# EAGLE design same51-dev (EAGLE 9.5.0)
COMPANY: -; CREVISION: 1.0; DESIGNER: Rafael Silva; LICENSE: Licensed under Creative Commons Attribution-ShareAlike 3.0 Unported; LINK: https://github.com/gimbas/labrob-same51-devboard
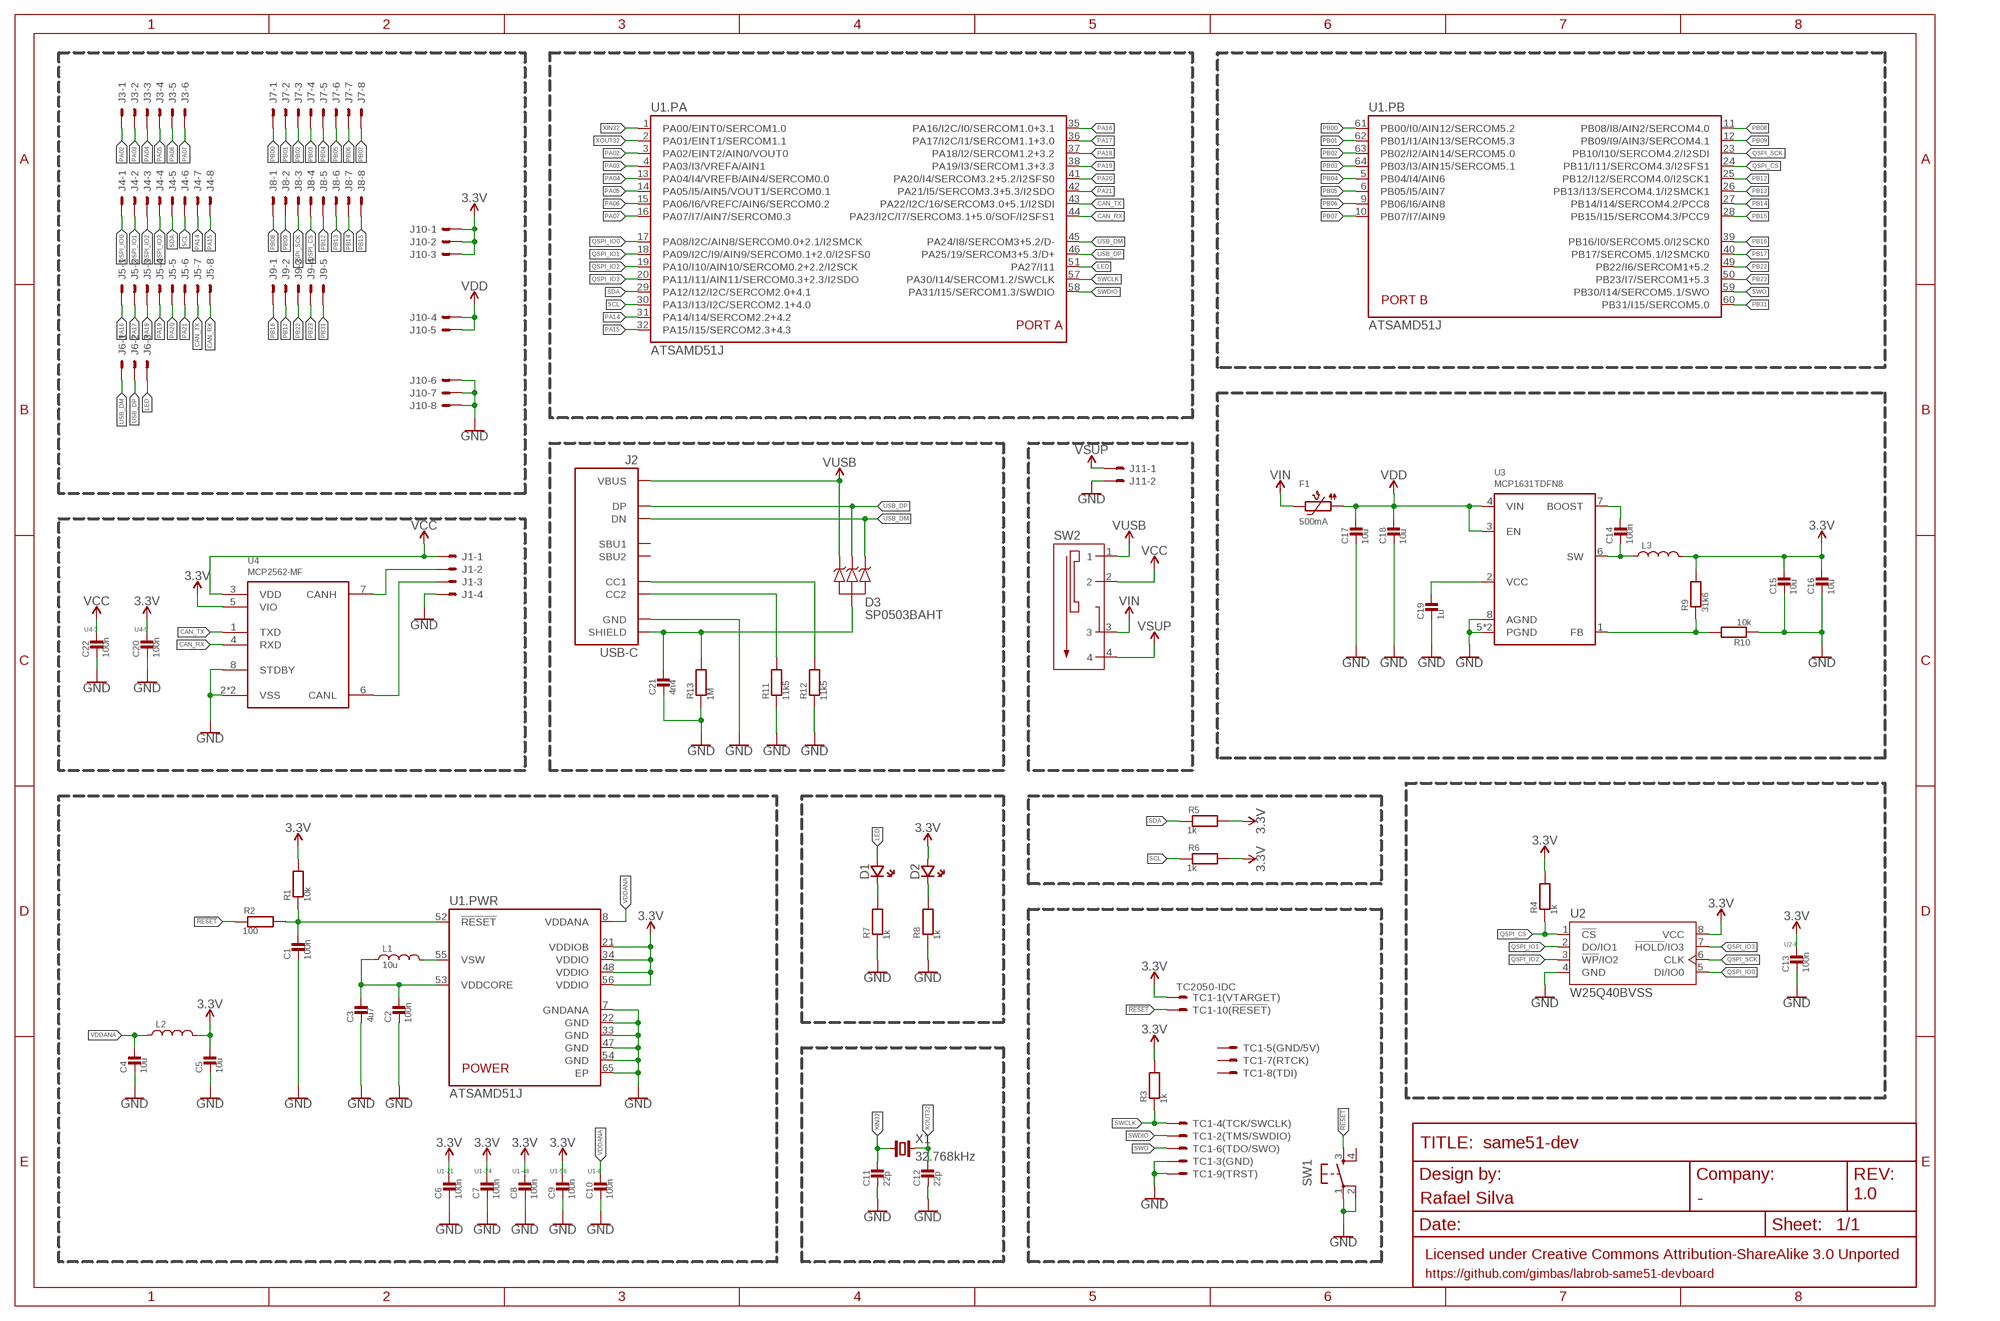
[diagram p0: schematic, sheet 1]

## Parts
C1  100n  MLCC0603  [0603_WAVE]
C2  100n  MLCC0603  [0603_WAVE]
C3  4u7  MLCC0603  [0603_WAVE]
C4  10u  MLCC0603  [0603_WAVE]
C5  10u  MLCC0603  [0603_WAVE]
C6  100n  MLCC0603  [0603_WAVE]
C7  100n  MLCC0603  [0603_WAVE]
C8  100n  MLCC0603  [0603_WAVE]
C9  100n  MLCC0603  [0603_WAVE]
C10  100n  MLCC0603  [0603_WAVE]
C11  22p  MLCC0603  [0603_WAVE]
C12  22p  MLCC0603  [0603_WAVE]
C13  100n  MLCC0603  [0603_WAVE]
C14  100n  MLCC0603  [0603_WAVE]
C15  10u  MLCC0603  [0603_WAVE]
C16  10u  MLCC0603  [0603_WAVE]
C17  10u  MLCC0603  [0603_WAVE]
C18  10u  MLCC0603  [0603_WAVE]
C19  1u  MLCC0603  [0603_WAVE]
C20  100n  MLCC0603  [0603_WAVE]
C21  4n4  MLCC0603  [0603_WAVE]
C22  100n  MLCC0603  [0603_WAVE]
D1  LED0603  [CHIPLED_0603]
D2  LED0603  [CHIPLED_0603]
D3  SP0503BAHT  [SOT143]
F1  500mA  PTC0805  [0805]
J1  4  [1X4_2.54]
J2  USB-C  [USB-C]
J3  6  [1X6_2.54]
J4  8  [1X8_2.54]
J5  8  [1X8_2.54]
J6  3  [1X3_2.54]
J7  8  [1X8_2.54]
J8  8  [1X8_2.54]
J9  5  [1X5_2.54]
J10  8  [1X8_2.54]
J11  2  [2X1_2.54]
L1  10u  INDUCTOR_NC_0806  [_0806]
L2  INDUCTOR_NC_0603  [_0603]
L3  INDUCTOR_NC_0806  [_0806]
R1  10k  RESISTOR0603  [0603_WAVE]
R2  100  RESISTOR0603  [0603_WAVE]
R3  1k  RESISTOR0603  [0603_WAVE]
R4  1k  RESISTOR0603  [0603_WAVE]
R5  1k  RESISTOR0603  [0603_WAVE]
R6  1k  RESISTOR0603  [0603_WAVE]
R7  1k  RESISTOR0603  [0603_WAVE]
R8  1k  RESISTOR0603  [0603_WAVE]
R9  31k6  RESISTOR0603  [0603_WAVE]
R10  10k  RESISTOR0603  [0603_WAVE]
R11  11k5  RESISTOR0603  [0603_WAVE]
R12  11k5  RESISTOR0603  [0603_WAVE]
R13  1M  RESISTOR0603  [0603_WAVE]
SW1  PUSH_BUTTON3X4X2  [3X4X2]
SW2  MSK-13C01  [MSK-13C01]
TC1  TC2050-IDC  [TC2050-IDC]
U1  ATSAMD51J  [VQFN64]
U2  W25Q40BVSS  [SO08-SS]
U3  MCP1631TDFN8  [TDFN8]
U4  MCP2562-MF  [DFN8]
X1  32.768kHz  CRYSTAL2-SMD-3215  [2-SMD-3215]

## Nets
3.3V: C5.P$1 C6.P$1 C7.P$1 C8.P$1 C9.P$1 C13.P$1 C15.P$1 C16.P$1 C20.P$1 D2.A(AN) J10.1 J10.2 J10.3 L2.2 L3.2 R1.P$2 R3.P$2 R4.P$2 R5.P$2 R6.P$2 R9.P$2 TC1.1 U1.21(.PWR:VDDIOB) U1.34(.PWR:VDDIO) U1.48(.PWR:VDDIO) U1.56(.PWR:VDDIO) U2.8(VCC) U4.5(VIO)
!RESET: R2.P$1 SW1.3 TC1.10
CAN_RX: J5.8 U1.44(.PA:PA23/I2C/I7/SERCOM3.1+5.0/SOF/I2SFS1) U4.4(RXD)
CAN_TX: J5.7 U1.43(.PA:PA22/I2C/16/SERCOM3.0+5.1/I2SDI) U4.1(TXD)
GND: C1.P$2 C2.P$2 C3.P$2 C4.P$2 C5.P$2 C6.P$2 C7.P$2 C8.P$2 C9.P$2 C10.P$2 C11.P$2 C12.P$2 C13.P$2 C15.P$2 C16.P$2 C17.P$2 C18.P$2 C19.P$2 C20.P$2 C21.P$2 C22.P$2 J1.4 J2.A1/B12(GND) J2.B1/A12(GND) J10.6 J10.7 J10.8 J11.2 R7.P$1 R8.P$1 R10.P$1 R11.P$1 R12.P$1 R13.P$1 SW1.1 SW1.2 TC1.3 TC1.9 U1.7(.PWR:GNDANA) U1.22(.PWR:GND) U1.33(.PWR:GND) U1.47(.PWR:GND) U1.54(.PWR:GND) U1.65(.PWR:EP) U2.4(GND) U3.5(PGND) U3.8(AGND) U3.9(PGND) U4.2(VSS) U4.8(STDBY) U4.9(VSS)
LED: D1.A(AN) J6.3 U1.51(.PA:PA27/I11)
N$1: C1.P$1 R1.P$1 R2.P$2 U1.52(.PWR:!RESET)
N$2: L1.2 U1.55(.PWR:VSW)
N$3: C2.P$1 C3.P$1 L1.1 U1.53(.PWR:VDDCORE)
N$4: C14.P$1 U3.7(BOOST)
N$5: C14.P$2 L3.1 U3.6(SW)
N$7: R9.P$1 R10.P$2 U3.1(FB)
N$8: C19.P$1 U3.2(VCC)
N$9: J1.3 U4.6(CANL)
N$11: J1.2 U4.7(CANH)
N$12: D1.C(CA) R7.P$2
N$13: C21.P$1 D3.1 J2.SHIELD0(SHIELD) J2.SHIELD1(SHIELD) J2.SHIELD2(SHIELD) J2.SHIELD3(SHIELD) R13.P$2
N$15: J2.B5(CC2) R11.P$2
N$16: J2.A5(CC1) R12.P$2
N$42: D2.C(CA) R8.P$2
PA02: J3.1 U1.3(.PA:PA02/EINT2/AIN0/VOUT0)
PA03: J3.2 U1.4(.PA:PA03/I3/VREFA/AIN1)
PA04: J3.3 U1.13(.PA:PA04/I4/VREFB/AIN4/SERCOM0.0)
PA05: J3.4 U1.14(.PA:PA05/I5/AIN5/VOUT1/SERCOM0.1)
PA06: J3.5 U1.15(.PA:PA06/I6/VREFC/AIN6/SERCOM0.2)
PA07: J3.6 U1.16(.PA:PA07/I7/AIN7/SERCOM0.3)
PA14: J4.7 U1.31(.PA:PA14/I14/SERCOM2.2+4.2)
PA15: J4.8 U1.32(.PA:PA15/I15/SERCOM2.3+4.3)
PA16: J5.1 U1.35(.PA:PA16/I2C/I0/SERCOM1.0+3.1)
PA17: J5.2 U1.36(.PA:PA17/I2C/I1/SERCOM1.1+3.0)
PA18: J5.3 U1.37(.PA:PA18/I2/SERCOM1.2+3.2)
PA19: J5.4 U1.38(.PA:PA19/I3/SERCOM1.3+3.3)
PA20: J5.5 U1.41(.PA:PA20/I4/SERCOM3.2+5.2/I2SFS0)
PA21: J5.6 U1.42(.PA:PA21/I5/SERCOM3.3+5.3/I2SDO)
PB00: J7.1 U1.61(.PB:PB00/I0/AIN12/SERCOM5.2)
PB01: J7.2 U1.62(.PB:PB01/I1/AIN13/SERCOM5.3)
PB02: J7.3 U1.63(.PB:PB02/I2/AIN14/SERCOM5.0)
PB03: J7.4 U1.64(.PB:PB03/I3/AIN15/SERCOM5.1)
PB04: J7.5 U1.5(.PB:PB04/I4/AIN6)
PB05: J7.6 U1.6(.PB:PB05/I5/AIN7)
PB06: J7.7 U1.9(.PB:PB06/I6/AIN8)
PB07: J7.8 U1.10(.PB:PB07/I7/AIN9)
PB08: J8.1 U1.11(.PB:PB08/I8/AIN2/SERCOM4.0)
PB09: J8.2 U1.12(.PB:PB09/I9/AIN3/SERCOM4.1)
PB12: J8.5 U1.25(.PB:PB12/I12/SERCOM4.0/I2SCK1)
PB13: J8.6 U1.26(.PB:PB13/I13/SERCOM4.1/I2SMCK1)
PB14: J8.7 U1.27(.PB:PB14/I14/SERCOM4.2/PCC8)
PB15: J8.8 U1.28(.PB:PB15/I15/SERCOM4.3/PCC9)
PB16: J9.1 U1.39(.PB:PB16/I0/SERCOM5.0/I2SCK0)
PB17: J9.2 U1.40(.PB:PB17/SERCOM5.1/I2SMCK0)
PB22: J9.3 U1.49(.PB:PB22/I6/SERCOM1+5.2)
PB23: J9.4 U1.50(.PB:PB23/I7/SERCOM1+5.3)
PB31: J9.5 U1.60(.PB:PB31/I15/SERCOM5.0)
QSPI_CS: J8.4 R4.P$1 U1.24(.PB:PB11/I11/SERCOM4.3/I2SFS1) U2.1(!CS!)
QSPI_IO0: J4.1 U1.17(.PA:PA08/I2C/AIN8/SERCOM0.0+2.1/I2SMCK) U2.5(DI/IO0)
QSPI_IO1: J4.2 U1.18(.PA:PA09/I2C/I9/AIN9/SERCOM0.1+2.0/I2SFS0) U2.2(DO/IO1)
QSPI_IO2: J4.3 U1.19(.PA:PA10/I10/AIN10/SERCOM0.2+2.2/I2SCK) U2.3(!WP!/IO2)
QSPI_IO3: J4.4 U1.20(.PA:PA11/I11/AIN11/SERCOM0.3+2.3/I2SDO) U2.7(!HOLD!/IO3)
QSPI_SCK: J8.3 U1.23(.PB:PB10/I10/SERCOM4.2/I2SDI) U2.6(CLK)
SCL: J4.6 R6.P$1 U1.30(.PA:PA13/I13/I2C/SERCOM2.1+4.0)
SDA: J4.5 R5.P$1 U1.29(.PA:PA12/I12/I2C/SERCOM2.0+4.1)
SWCLK: R3.P$1 TC1.4 U1.57(.PA:PA30/I14/SERCOM1.2/SWCLK)
SWDIO: TC1.2 U1.58(.PA:PA31/I15/SERCOM1.3/SWDIO)
SWO: TC1.6 U1.59(.PB:PB30/I14/SERCOM5.1/SWO)
USB_DM: D3.4 J2.A7(DN) J2.B7(DN) J6.1 U1.45(.PA:PA24/I8/SERCOM3+5.2/D-)
USB_DP: D3.3 J2.A6(DP) J2.B6(DP) J6.2 U1.46(.PA:PA25/19/SERCOM3+5.3/D+)
VCC: C22.P$1 J1.1 SW2.2 U4.3(VDD)
VDD: C17.P$1 C18.P$1 F1.1 J10.4 J10.5 U3.3(EN) U3.4(VIN)
VDDANA: C4.P$1 C10.P$1 L2.1 U1.8(.PWR:VDDANA)
VIN: F1.2 SW2.3
VSUP: J11.1 SW2.4
VUSB: D3.2 J2.A4/B9(VBUS) J2.B4/A9(VBUS) SW2.1
XIN32: C11.P$1 U1.1(.PA:PA00/EINT0/SERCOM1.0) X1.1
XOUT32: C12.P$1 U1.2(.PA:PA01/EINT1/SERCOM1.1) X1.2
Unconnected: J2.A8(SBU1) J2.B8(SBU2) SW1.4 TC1.5 TC1.7 TC1.8

## Notes on the sheet
- U4-3 | U4-5
- U2-8
- U1-21 | U1-34 | U1-48 | U1-56 | U1-8

## Library data of the parts
C1-C22 = Passive Components > Capacitors > Multilayer Ceramic Capacitors MLCC:MLCC: KEMET’s X7R dielectric features a 125°C maximum operating temperature and is considered temperature stable. The Electronics Components, Assemblies and Materials Association (EIA) characterizes X7R dielectric as a Class II material. Components of this classification are fixed, ceramic dielectric capacitors suited for bypass and decoupling applications or for frequency discriminating circuits where Q and stability of capacitance characteristics are not critical. X7R exhibits a predictable change in capacitance with respect to time and voltage, boasting a minimal change in capacitance with reference to ambient temperature. Capacitance change is limited to ±15% from −55°C to +125°C.
D1 D2 = Opto-electronics > LED Emitters:LED: LED 0603 - 0603 Surface Mount Package 2mA: Green LED - Low Power (3.9mcd, 2ma, 1.7Vf) - Digikey: 475-2709-2-ND Orange LED - Low Power (9.8mcd, 2ma, 1.8Vf) - Digikey: 475-1194-2-ND Red LED - Low Power (5mcd, 2ma, 1.8Vf) - Digikey: 475-1195-2-ND Yellow LED - Low Power (7mcd, 2ma, 1.8Vf) - Digikey: 475-1196-2-ND 5mA: Blue LED - Low Power (17mcd, 5ma, 2.9Vf) - Digikey: LNJ937W8CRACT-ND 0805 - 0805 Surface Mount Package 2mA: Red LED (8.8mcd, 2mA, 1.8Vf, Clear) - Low Power [Digikey: 475-2510-1-ND] Green LED (5mcd, 2mA, 1.8Vf, Clear) - Low Power [Digikey: 475-2730-1-ND] Yellow LED (11.3mcd, 2mA, 1.8Vf, Clear) - Low Power [Digikey: 475-2555-1-ND] 20mA: Red LED (104mcd, 20mA, Diffused) - LS R976 [Digikey: 475-1278-6-ND] Red LED (12mcd, 20mA, 2.0Vf, Clear) - APT2012EC [Digikey: 754-1128-1-ND] Green LED (15mcd, 20mA, 2.2Vf, Clear) - APT2012GC [Digikey: 754-1131-1-ND] Orange LED (160mcd, 20mA, 2.1Vf, Clear) - APT2012SECK [Digikey: 754-1130-1-ND] 1206 - 1206 Surface Mount Package Green LED (26mcd, 20mA, Diffused) - LG N971 [Digikey: 475-1407-6-ND] Red LED (15mcd, 20mA, Diffused) - LH N974 [Digikey: 475-1416-6-ND] Cree - Cree High-Power Surface Mount LEDs XPEBWT-L1-0000-00D50 - White 111lm 350mA 2.9Vf 6200K 110° XTEAWT-00-0000-00000LEE3 - White 114lm 350mA 2.85Vf 5000K 115° Everlight - Everlight 45-21 Series Surface Mount LEDs 45-21/QK2C-B2832AC2CB2/2T - Warm White 2000mcd 20mA 3.25Vf 3050K 120° 45-21/LK2C-B38452C4CB2/2T - Nuetral White 2000mcd 20mA 3.25Vf 4150K 120° 45-21/LK2C-B50634C6CB2/2T - Cold White 2200mcd 20mA 3.25Vf 5650K 120° PLCC2 Reverse Mount LS T77K-J1L2-1-0-2-R18-Z - Red 11.25mcd 2mA 1.8Vf 630nm 120° LO T77K-L1M2-24-Z - Orange 19.6mcd 2mA 1.8Vf 606nm 120° LY T77K-K2M1-26-Z - Yellow 15.7mcd 2mA 1.8Vf 587nm 120°
D3 = Circuit Protection > ESD Suppressors \ TVS Diodes:SP0503BAHT
F1 = Circuit Protection > Resettable Fuses - PPTC:PTC
J1 = Connectors > Header:4
J2 = Connectors > USB:USB-C
J3 = Connectors > Header:6
J4 J5 J7 J8 J10 = Connectors > Header:8
J6 = Connectors > Header:3
J9 = Connectors > Header:5
J11 = Connectors > Header:2
L1-L3 = Passive Components > Inductors, Chokes & Coils:INDUCTOR_NC
R1-R13 = Passive Components > Resistors > Chip Resistors:RESISTOR: Resistors For new designs, use the packages preceded by an '_' character since they are more reliable: The following footprints should be used on most boards: _0402 - Standard footprint for regular board layouts _0603 - Standard footprint for regular board layouts _0805 - Standard footprint for regular board layouts _1206 - Standard footprint for regular board layouts For extremely tight-pitch boards where space is at a premium, the following 'micro-pitch' footprints can be used (smaller pads, no silkscreen outline, etc.): _0402MP - Micro-pitch footprint for very dense/compact boards _0603MP - Micro-pitch footprint for very dense/compact boards _0805MP - Micro-pitch footprint for very dense/compact boards _1206MP - Micro-pitch footprint for very dense/compact boards
SW1 = Eletromechanical > Switches > Tactile Switches:PUSH_BUTTON
SW2 = Eletromechanical > Switches > Toggle Switches:MSK-13C01
TC1 = Connectors > Other:TC2050-IDC
U1 = Semiconductors > Embedded Processors & Controllers > Microcontrollers - MCU:ATSAMD51J: ATSAMD51J cortex m4 microcontroller
U2 = Semiconductors > Integrated Circuits - ICs > Memory ICs > Flash:W25Q40BV: EEPROM 4 Mbit SPI Serial Flash with Dual and Quad SPI
U3 = Power > Switching Controllers:MCP1631*
U4 = Semiconductors > Integrated Circuits - ICs > Interface ICs > CAN Interface IC:MCP2562
X1 = Passive Components > Frequency Control & Timing Devices > Crystals:CRYSTAL

## Board
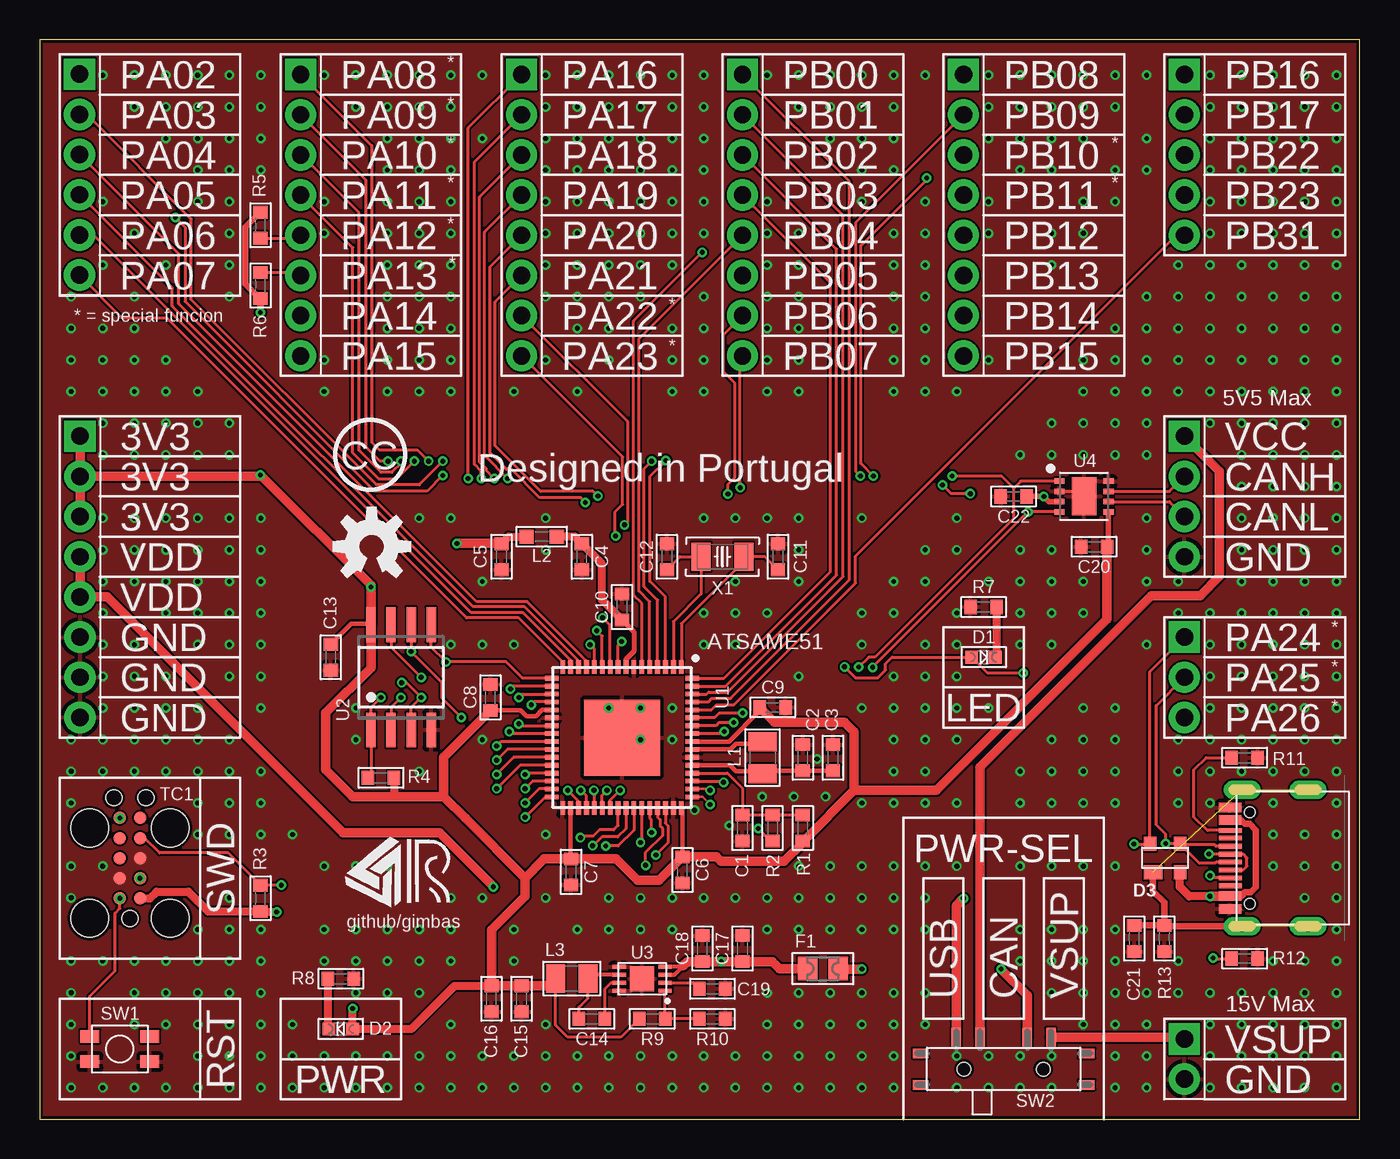
[diagram p1: board, top side]
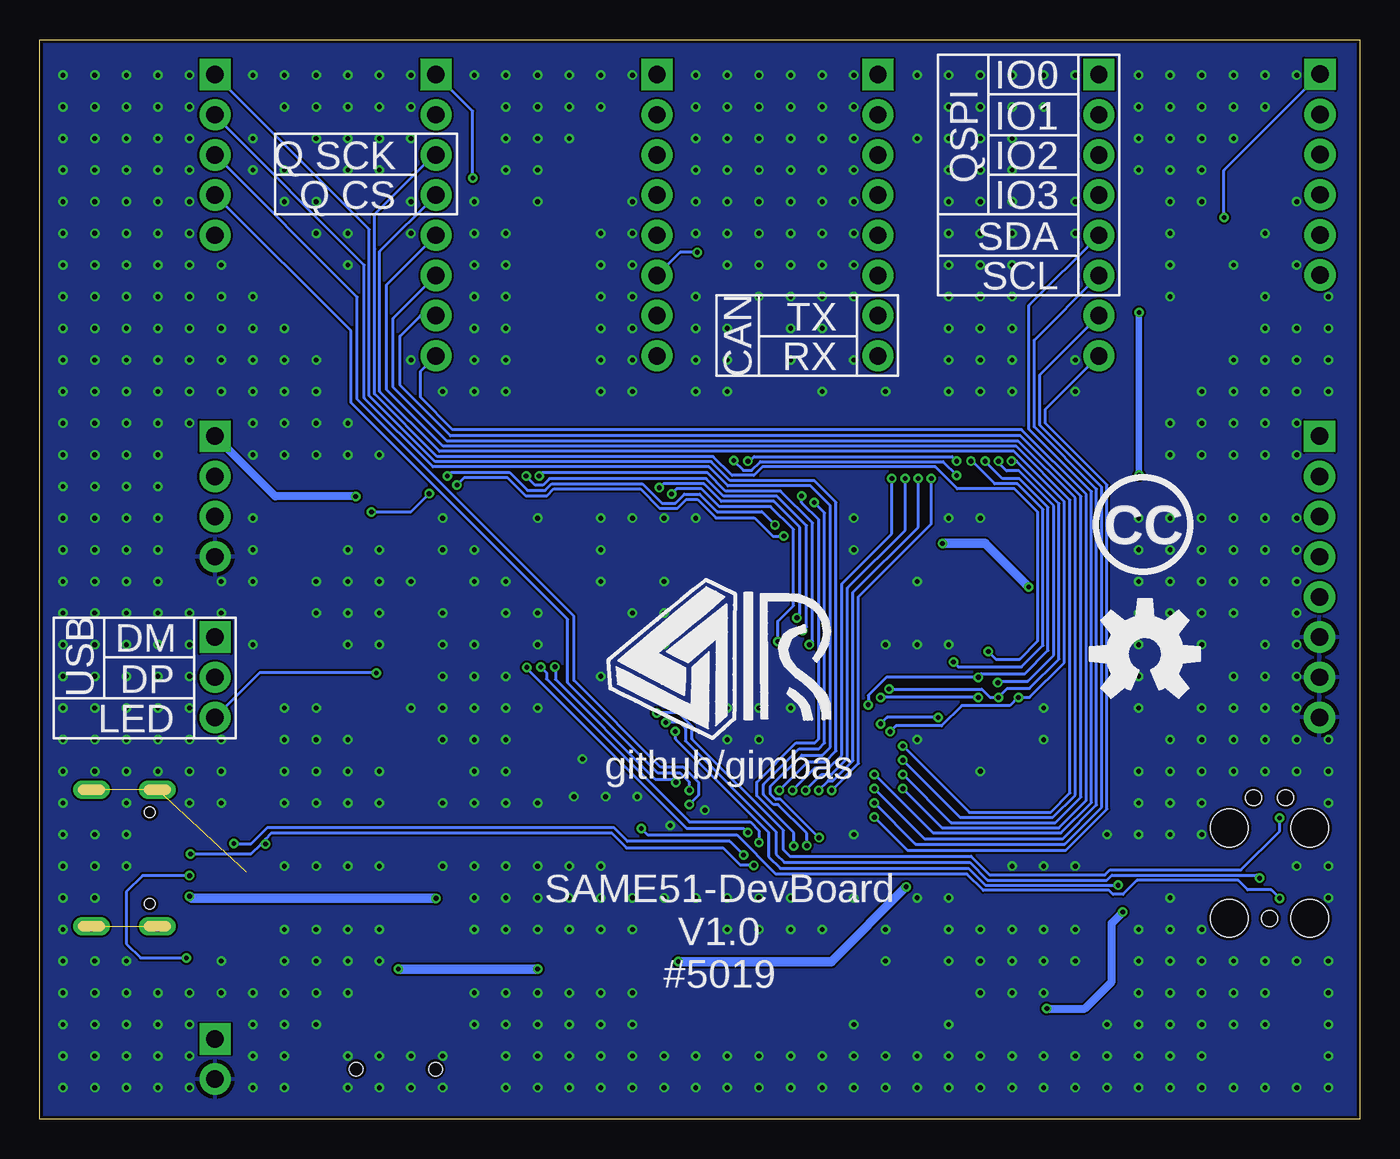
[diagram p2: board, bottom side, seen from below]

Size 83.49 x 68.25 mm. Coordinates in mm from the lower left corner, seen from the top.
Outline: 0,0 83.49,0 83.49,68.25 0,68.25 0,0
Copper layers (1*16): Top 0.035mm / dielectric 1.2mm / Bottom 0.035mm
Design rules "jlcpcb-2l-dr": minimum track width 5mil, minimum drill 0.3mm, track to track 5mil, track to pad 5mil, pad to pad 5mil, via to via 5mil, smd to smd 5mil, copper to edge 0.2mm, drill to drill 5mil, minimum pad ring 3mil, minimum via ring 3mil, stop-mask expansion 4mil, vias tented up to drill 0.5mm, thermal gap 10mil

### Footprints (pad centres in the part's own frame; a part is rotated, then mirrored left to right if it is on the bottom)
0603_WAVE = smd 0.8 x 0.9: P$1 -0.823,0; P$2 0.823,0
CHIPLED_0603 = smd 0.8 x 0.8: A 0,-0.75; C 0,0.75
SOT143 = smd 1.2 x 0.9: 1 -0.711,-0.889 | smd 0.8 x 0.9: 2 0.989,-0.889; 3 0.989,0.911; 4 -0.911,0.911
0805 = smd 1.245 x 1.473: 1 -0.965,0; 2 0.965,0
1X4_2.54 = drill 1.1 square: 1 -3.81,0 | drill 1.1: 2 -1.27,0; 3 1.27,0; 4 3.81,0
USB-C = smd 0.6 x 1.4: A1/B12 -3.2,7.276; A4/B9 -2.4,7.276; B1/A12 3.2,7.276; B4/A9 2.4,7.276 | smd 0.3 x 1.45: A5 -1.25,7.251; A6 -0.25,7.251; A7 0.25,7.251; A8 -1.75,7.251; B5 1.75,7.251; B6 0.75,7.251; B7 -0.75,7.251; B8 1.27,7.251 | drill 0.65 pad 1 long: SHIELD0 -4.32,6.526; SHIELD1 -4.32,2.346; SHIELD2 4.32,2.346; SHIELD3 4.32,6.526 | hole 0.65: -2.89,6.026; 2.89,6.026
1X6_2.54 = drill 1.1 square: 1 -2.54,0 | drill 1.1: 2 0,0; 3 2.54,0; 4 5.08,0; 5 7.62,0; 6 10.16,0
1X8_2.54 = drill 1.1 square: 1 -8.89,0 | drill 1.1: 2 -6.35,0; 3 -3.81,0; 4 -1.27,0; 5 1.27,0; 6 3.81,0; 7 6.35,0; 8 8.89,0
1X3_2.54 = drill 1.1 square: 1 -2.54,0 | drill 1.1: 2 0,0; 3 2.54,0
1X5_2.54 = drill 1.1 square: 1 -2.54,0 | drill 1.1: 2 0,0; 3 2.54,0; 4 5.08,0; 5 7.62,0
2X1_2.54 = drill 1.1 square: 1 -1.27,0 | drill 1.1: 2 1.27,0
_0806 = smd 1.2 x 1.8: 1 -1.016,0; 2 1.016,0
_0603 = smd 0.9 x 0.9: 1 -0.95,0; 2 0.95,0
3X4X2 = smd 1.2 x 0.8: 1 -1.9,0.8; 2 1.9,0.8; 3 1.9,-0.8; 4 -1.9,-0.8
MSK-13C01 = smd 0.6 x 1.2: 1 -3,2; 2 -1.5,2; 3 1.5,2; 4 3,2 | smd 1 x 0.6: S1 -5.25,1; S2 -5.25,-1; S3 5.25,1; S4 5.25,-1 | hole 0.85: -2.5,0; 2.5,0
TC2050-IDC = smd 0.787 x 0.787: 1 -2.54,-0.635; 2 -1.27,-0.635; 3 0,-0.635; 4 1.27,-0.635; 5 2.54,-0.635; 6 2.54,0.635; 7 1.27,0.635; 8 0,0.635; 9 -1.27,0.635; 10 -2.54,0.635 | hole 0.991: -3.81,0; 3.81,1.016; 3.81,-1.016 | hole 2.375: -3.81,2.54; -3.81,-2.54; 1.905,2.54; 1.905,-2.54
VQFN64 = smd 0.85 x 0.3: 1 -4.45,3.75; 2 -4.45,3.25; 3 -4.45,2.75; 4 -4.45,2.25; 5 -4.45,1.75; 6 -4.45,1.25; 7 -4.45,0.75; 8 -4.45,0.25; 9 -4.45,-0.25; 10 -4.45,-0.75; 11 -4.45,-1.25; 12 -4.45,-1.75; 13 -4.45,-2.25; 14 -4.45,-2.75; 15 -4.45,-3.25; 16 -4.45,-3.75; 33 4.45,-3.75; 34 4.45,-3.25; 35 4.45,-2.75; 36 4.45,-2.25; 37 4.45,-1.75; 38 4.45,-1.25; 39 4.45,-0.75; 40 4.45,-0.25; 41 4.45,0.25; 42 4.45,0.75; 43 4.45,1.25; 44 4.45,1.75; 45 4.45,2.25; 46 4.45,2.75; 47 4.45,3.25; 48 4.45,3.75 | smd 0.3 x 0.85: 17 -3.75,-4.45; 18 -3.25,-4.45; 19 -2.75,-4.45; 20 -2.25,-4.45; 21 -1.75,-4.45; 22 -1.25,-4.45; 23 -0.75,-4.45; 24 -0.25,-4.45; 25 0.25,-4.45; 26 0.75,-4.45; 27 1.25,-4.45; 28 1.75,-4.45; 29 2.25,-4.45; 30 2.75,-4.45; 31 3.25,-4.45; 32 3.75,-4.45; 49 3.75,4.45; 50 3.25,4.45; 51 2.75,4.45; 52 2.25,4.45; 53 1.75,4.45; 54 1.25,4.45; 55 0.75,4.45; 56 0.25,4.45; 57 -0.25,4.45; 58 -0.75,4.45; 59 -1.25,4.45; 60 -1.75,4.45; 61 -2.25,4.45; 62 -2.75,4.45; 63 -3.25,4.45; 64 -3.75,4.45 | smd 4.8 x 4.8: 65 0,0
SO08-SS = smd 0.6 x 2.2: 1 -1.905,-3.33; 2 -0.635,-3.33; 3 0.635,-3.33; 4 1.905,-3.33; 5 1.905,3.33; 6 0.635,3.33; 7 -0.635,3.33; 8 -1.905,3.33
TDFN8 = smd 0.85 x 0.25: 1 -1.45,0.75; 2 -1.45,0.25; 3 -1.45,-0.25; 4 -1.45,-0.75; 5 1.45,-0.75; 6 1.45,-0.25; 7 1.45,0.25; 8 1.45,0.75 | smd 1.5 x 1.6: 9 0,0
DFN8 = smd 0.65 x 0.35: 1 -1.55,0.975; 2 -1.55,0.325; 3 -1.55,-0.325; 4 -1.55,-0.975; 5 1.55,-0.975; 6 1.55,-0.325; 7 1.55,0.325; 8 1.55,0.975 | smd 1.55 x 2.4: 9 0,0
2-SMD-3215 = smd 1.2 x 1.8: 1 -1.35,0; 2 1.35,0

### Placement (x,y rotation side)
C1  44.45,18.41 270 top
C2  48.26,22.86 90 top
C3  50.16,22.86 90 top
C4  34.29,35.56 270 top
C5  29.21,35.56 270 top
C6  40.65,15.76 270 top
C7  33.61,15.64 270 top
C8  28.51,26.67 90 top
C9  46.35,26.04 0 top
C10  36.83,32.38 90 top
C11  46.69,35.56 90 top
C12  39.67,35.56 90 top
C13  18.41,29.21 270 top
C14  34.92,6.35 180 top
C15  30.48,7.62 270 top
C16  28.57,7.62 270 top
C17  44.45,10.79 90 top
C18  41.91,10.79 90 top
C19  42.55,8.26 0 top
C20  66.67,36.2 180 top
C21  69.22,11.43 270 top
C22  61.59,39.37 180 top
D1  59.69,29.21 270 top
D2  19.05,5.71 90 top
D3  71.12,16.51 0 top
F1  49.53,9.53 0 top
J1  72.39,39.37 270 top
J2  82.55,16.51 90 top
J3  2.53,63.52 270 top
J4  16.51,57.15 270 top
J5  30.48,57.15 270 top
J6  72.39,27.94 270 top
J7  44.45,57.15 270 top
J8  58.42,57.15 270 top
J9  72.39,63.5 270 top
J10  2.56,34.29 270 top
J11  72.39,3.81 270 top
L1  45.72,22.86 90 top
L2  31.75,36.83 180 top
L3  33.66,8.89 180 top
R1  48.26,18.41 270 top
R2  46.35,18.41 90 top
R3  13.97,13.97 270 top
R4  21.59,21.59 0 top
R5  13.97,56.52 90 top
R6  13.97,52.7 270 top
R7  59.69,32.38 0 top
R8  19.05,8.89 180 top
R9  38.73,6.35 180 top
R10  42.55,6.35 180 top
R11  76.2,22.86 180 top
R12  76.2,10.16 180 top
R13  71.12,11.43 90 top
SW1  5.08,4.45 180 top
SW2  60.96,3.17 0 top
TC1  5.71,16.51 90 top
U1  36.83,24.13 270 top
U2  22.86,27.94 0 top
U3  38.1,8.89 180 top
U4  66.04,39.37 0 top
U$1  [OSHW-LOGO-L]  13.6,29.4 0 bottom
U$2  [RAFAEL_SILVA_10MM_ALT]  47.5,24.1 0 bottom
U$3  [RAFAEL_SILVA_5MM_ALT_3]  20.1,15.4 0 top
U$4  [OSHW-LOGO-M]  21,36.2 0 top
X1  43.18,35.56 180 top

### Tracks (layer width: path | path; a pad name or v marks a point on that pad's centre or on a via)
3.3V  (via drill 0.3 pad 0.6)
  Top 0.2: 45.53,25.82 C9.P$1 | 67.59,36.29 C20.P$1 | R9.P$2 36.76,5.2 33.4,5.2 32.64,5.96 L3.2
  Top 0.3: C8.P$1 30.41,25.85 30.78,25.48 31.38,25.48 31.78,25.88 U1.21 | U1.56 43.03,23.88 43.04,23.87 43.57,23.87 43.58,23.88 43.59,23.88 45.53,25.82 | U1.34 33.58,16.67 C7.P$1 | C13.P$1 19.71,31.33 20.93,31.33 20.95,31.36 | 20.95,30.45 U2.8 | U1.48 40.65,19.61 C6.P$1
  Top 0.35: U4.5 67.59,36.29
  Top 0.4: 20.95,30.45 20.95,31.36
  Top 0.406: R5.P$2 13.94,57.34 13,56.4 13,52.8 13.92,51.88 R6.P$2 v13.97,51
  Top 0.5: C5.P$1 29.66,36.83 L2.2 | L3.2 32.19,8.44 | TC1.1 6.97,13.97 7.4,14.4 9.4,14.4 10.65,13.15 R3.P$2 14.02,13.1 v15,13.1 | C16.P$1 26.24,8.44 23.52,5.71 D2.A v19.8,7 | R4.P$2 22.41,20.41 22.4,20.4 | R1.P$2 48.29,17.59 | v20.95,33.66 20.95,33.74 | 14.06,40.64 v13.97,40.73 | 67.5,31.6 57.4,21.5
  Top 0.6: 47.07,16.3 48.26,17.49 | 48.29,17.59 51.5,20.8 56.7,20.8 67.5,31.6 C20.P$1 | 14.06,40.64 J10.2 | J10.2 J10.3 | J10.2 J10.1 | v26.4,36.4 29.19,36.4 C5.P$1 | 26.93,19.03 25.55,20.4 | 25.55,20.4 23.6,20.4 | 25.55,20.4 25.55,22.89 C8.P$1 | C7.P$1 31.91,16.46 30.7,15.25 30.7,14.1 28.57,11.97
  Top 0.61: 32.19,8.44 C15.P$1 C16.P$1 28.57,11.97 | 20.95,30.45 20.95,28.55 18.1,25.7 18.1,22.1 19.8,20.4 22.4,20.4 23.6,20.4 | 26.93,19.03 30.7,15.25 | C7.P$1 36.44,16.46 37.8,15.1 39.16,15.1 C6.P$1 42.81,16.59 43.1,16.3 47.07,16.3 | 48.26,17.49 R1.P$2 | C9.P$1 46.47,25.1 50.9,25.1 51.5,24.5 51.5,20.8 | U2.8 v20.95,33.66 | 20.95,33.74 14.06,40.64
  Bottom 0.406: v13.97,40.73 v13.97,51
  Bottom 0.5: v19.8,7 17.4,7 15.7,8.7 15.7,12.4 v15,13.1
  Bottom 0.6: 23.68,36.38 23.7,36.4 v26.4,36.4
  Bottom 0.61: v20.95,33.66 23.68,36.38
!RESET  (via drill 0.3 pad 0.6)
  Top 0.2: R2.P$1 46.23,17.59 v45.44,18.38 | SW1.3 3.18,7.78 4.78,9.38 4.78,13.03 5.08,13.33 TC1.10
  Bottom 0.2: TC1.10 5.61,14.5 7.1,14.5 7.7,15.1 14.1,15.1 14.98,14.22 15.62,14.22 15.87,14.47 23.82,14.47 24.85,15.5 36.92,15.5 39.4,17.98 45.04,17.98 v45.44,18.38
  other vias: 5.08,13.97
CAN_RX  (via drill 0.3 pad 0.6)
  Top 0.2: U1.44 38.58,19.04 38.68,18.94 38.68,18.15 v38.7,18.12 | v52.67,28.57 v62.5,38.4 U4.4 | v58.86,39.54 57.65,39.54 v57.1,40.1 | v36.43,36.87 36.36,36.93 36.36,38.36 36.87,38.87 36.87,41.87 J5.8
  Bottom 0.2: v38.7,18.12 38.95,18.37 42.55,18.37 52.67,28.49 v52.67,28.57 | v62.5,38.4 60.01,38.4 v58.86,39.54 | v57.1,40.1 56.62,40.57 53.92,40.57 52.77,39.43 51.39,39.43 50.97,39.85 45.5,39.85 44.28,38.62 43.15,38.62 42.58,39.19 41.89,39.19 40.72,38.02 38.29,38.02 37.13,36.87 v36.43,36.87
CAN_TX  (via drill 0.3 pad 0.6)
  Top 0.2: U4.1 62.05,40.34 61.6,39.9 | 61.6,39.9 61.6,38 52.82,29.22 52.43,29.22 v51.8,28.59 | v38,17.5 38.08,17.58 U1.43 | 61.6,39.9 60.84,40.66 v57.7,40.66 | v36.99,37.58 37.2,37.79 37.2,44.08 J5.7
  Bottom 0.2: v51.8,28.59 51.44,28.23 51.44,27.84 42.4,18.8 38.55,18.8 38,18.25 v38,17.5 | v57.7,40.66 57.46,40.9 53.78,40.9 52.64,39.76 51.53,39.76 51.11,40.17 45.37,40.17 44.14,38.95 43.29,38.95 42.72,39.52 41.76,39.52 40.64,38.41 37.81,38.41 v36.99,37.58
GND  (via drill 0.3)
  Top 0.2: U4.2 65.72,39.7 U4.9
  other vias: 2,2 4,2 6,2 8,2 10,2 12,2 14,2 16,2 18,2 20,2 22,2 24,2 26,2 28,2 30,2 32,2 34,2 36,2 38,2 40,2 42,2 44,2 46,2 48,2 50,2 52,2 54,2 58,2 60,2 62,2 64,2 68,2 70,2 74,2 76,2 78,2 80,2 82,2 2,4 10,4 12,4 14,4 16,4 18,4 20,4 22,4 24,4 26,4 28,4 30,4 32,4 34,4 36,4 38,4 40,4 42,4 44,4 46,4 48,4 50,4 52,4 54,4 58,4 60,4 62,4 64,4 68,4 70,4 74,4 76,4 78,4 80,4 82,4 2,6 6,6 8,6 10,6 12,6 14,6 16,6 26,6 32,6 46,6 48,6 50,6 52,6 54,6 56,6 66,6 68,6 70,6 74,6 76,6 78,6 80,6 82,6 2,8 6,8 8,8 10,8 12,8 14,8 20,8 22,8 24,8 46,8 48,8 50,8 52,8 54,8 56,8 64,8 66,8 68,8 70,8 72,8 74,8 76,8 78,8 80,8 82,8 2,10 4,10 6,10 8,10 10,10 12,10 14,10 18,10 20,10 22,10 24,10 26,10 30,10 62,10 64,10 66,10 68,10 72,10 78,10 80,10 82,10 10,12 12,12 14,12 18,12 20,12 22,12 24,12 26,12 30,12 34,12 36,12 38,12 40,12 46,12 48,12 50,12 52,12 54,12 56,12 62,12 64,12 66,12 68,12 82,12 2,14 12,14 26,14 28,14 32,14 36,14 38,14 40,14 42,14 44,14 46,14 48,14 50,14 52,14 54,14 56,14 80,14 82,14 2,16 4,16 18,16 20,16 22,16 48,16 50,16 52,16 54,16 56,16 58,16 62,16 64,16 66,16 68,16 78,16 80,16 82,16 10,18 12,18 14,18 16,18 32,18 78,18 80,18 82,18 2,20 10,20 12,20 14,20 45.7,20.4 47.7,20.4 49.7,20.4 52,20 54,20 56,20 58,20 62,20 64,20 66,20 68,20 72,20 74,20 78,20 82,20 2,22 4,22 6,22 8,22 10,22 12,22 14,22 24,22 54,22 56,22 62,22 64,22 66,22 68,22 72,22 74,22 76,22 78,22 80,22 82,22 2,24 4,24 6,24 8,24 10,24 12,24 20,24 28,24 38,24 40,24 54,24 56,24 58,24 64,24 66,24 68,24 72,24 74,24 76,24 78,24 80,24 82,24 4,26 6,26 8,26 10,26 14,26 20,26 36,26 38,26 40,26 52,26 54,26 56,26 58,26 60,26 66,26 68,26 74,26 76,26 78,26 80,26 82,26 4,28 6,28 8,28 12,28 14,28 48,28 54,28 56,28 58,28 74,28 76,28 78,28 80,28 82,28 4,30 6,30 10,30 12,30 14,30 26,30 28,30 30,30 42,30 44,30 52,30 56,30 58,30 62,30 64,30 70,30 74,30 76,30 78,30 80,30 82,30 4,32 8,32 10,32 12,32 14,32 42,32 44,32 46,32 52,32 54,32 58,32 62,32 64,32 66,32 72,32 74,32 76,32 78,32 80,32 82,32 4,34 6,34 8,34 10,34 12,34 14,34 28,34 44,34 48,34 54,34 56,34 60,34 62,34 64,34 66,34 70,34 72,34 76,34 78,34 80,34 82,34 4,36 6,36 8,36 10,36 12,36 14,36 32,36 48,36 56,36 58,36 62,36 64,36 70,36 76,36 78,36 80,36 82,36 4,38 6,38 8,38 10,38 12,38 14,38 24,38 26,38 32,38 42,38 44,38 46,38 48,38 52,38 58,38 70,38 76,38 78,38 80,38 82,38 76,40 78,40 80,40 82,40 4,42 6,42 8,42 10,42 12,42 62,42 64,42 66,42 68,42 70,42 76,42 78,42 80,42 82,42 4,44 6,44 8,44 10,44 12,44 64,44 66,44 68,44 70,44 74,44 76,44 78,44 80,44 82,44 2,46 4,46 6,46 8,46 10,46 18,46 22,46 24,46 26,46 30,46 34,46 40,46 42,46 46,46 48,46 54,46 56,46 58,46 66,46 68,46 70,46 72,46 74,46 76,46 78,46 80,46 82,46 2,48 4,48 6,48 8,48 18,48 22,48 24,48 26,48 32,48 36,48 40,48 42,48 46,48 48,48 54,48 56,48 60,48 66,48 68,48 70,48 72,48 74,48 76,48 78,48 80,48 82,48 2,50 4,50 6,50 22,50 24,50 26,50 34,50 36,50 40,50 42,50 46,50 48,50 54,50 56,50 68,50 70,50 72,50 74,50 76,50 78,50 80,50 82,50 2,52 6,52 12,52 22,52 24,52 26,52 32,52 34,52 36,52 38,52 42,52 46,52 48,52 54,52 56,52 70,52 72,52 74,52 76,52 78,52 80,52 82,52 4,54 8,54 12,54 22,54 24,54 26,54 32,54 34,54 36,54 38,54 40,54 46,54 48,54 54,54 56,54 64,54 72,54 74,54 76,54 78,54 80,54 82,54 6,56 12,56 18,56 22,56 24,56 26,56 32,56 34,56 36,56 38,56 40,56 42,56 46,56 48,56 54,56 56,56 60,56 64,56 66,56 74,56 76,56 78,56 80,56 82,56 4,58 10,58 12,58 18,58 22,58 24,58 26,58 32,58 34,58 36,58 38,58 40,58 42,58 46,58 52,58 56,58 60,58 66,58 68,58 74,58 76,58 78,58 80,58 82,58 10,60 12,60 14,60 22,60 24,60 26,60 32,60 34,60 36,60 38,60 40,60 42,60 52,60 54,60 62,60 64,60 68,60 70,60 74,60 76,60 78,60 80,60 82,60 8,62 10,62 12,62 14,62 22,62 24,62 26,62 28,62 32,62 34,62 36,62 38,62 40,62 42,62 50,62 52,62 54,62 60,62 62,62 64,62 66,62 70,62 74,62 76,62 78,62 80,62 82,62 6,64 8,64 10,64 12,64 14,64 20,64 22,64 24,64 26,64 32,64 34,64 36,64 38,64 40,64 42,64 48,64 50,64 52,64 54,64 60,64 62,64 64,64 66,64 68,64 74,64 76,64 78,64 80,64 82,64 4,66 6,66 8,66 10,66 12,66 14,66 18,66 20,66 22,66 24,66 26,66 28,66 32,66 34,66 36,66 38,66 40,66 42,66 46,66 48,66 50,66 52,66 54,66 56,66 60,66 62,66 64,66 66,66 68,66 70,66 74,66 76,66 78,66 80,66 82,66 49.16,22.77 41.41,19.54 43.62,18.57
  pour Bottom: -0.2,68.6 83.7,68.6 83.7,-0.2 -0.2,-0.2
  pour Top: -0.3,68.6 83.6,68.6 83.6,-0.2 -0.3,-0.2
LED  (via drill 0.3 pad 0.6)
  Top 0.2: U1.51 43.17,21.38 v43.25,21.3 | v50.9,28.6 51.6,27.9 53,27.9 53.5,28.4 53.5,28.8 53.91,29.21 D1.A 59.94,28.21 v62.19,28.21
  Bottom 0.2: J6.3 69.58,28.21 v62.19,28.21 | v43.25,21.3 43.45,21.5 44.56,21.5 50.88,27.82 50.88,28.58 v50.9,28.6
N$1
  Top 0.2: U1.52 43.49,21.88 44.45,20.92 C1.P$1 R2.P$2 R1.P$1
N$2
  Top 0.2: L1.2 45.57,23.73 45.4,23.73
  Top 0.3: U1.55 43.7,23.38 44.05,23.73 45.4,23.73
N$3
  Top 0.2: L1.1 45.57,21.99 45.3,21.99 | C2.P$1
  Top 0.3: U1.53 43.66,22.38 44.05,21.99 45.3,21.99 | L1.1 45.92,22.04 C2.P$1 | C2.P$1 C3.P$1
N$4
  Top 0.2: C14.P$1 35.75,8.25 36.14,8.64 U3.7
N$5
  Top 0.2: C14.P$2 34.1,7.09 34.67,7.66 L3.1 34.92,9.14
  Top 0.25: U3.6 34.92,9.14
N$7
  Top 0.2: U3.1 R9.P$1 R10.P$2
N$8
  Top 0.2: U3.2 41.34,8.64 C19.P$1
N$9
  Top 0.2: U4.6 71.44,39.05 J1.3
N$11
  Top 0.2: U4.7 71.44,39.7 J1.2
N$12
  Top 0.5: R7.P$2 60.51,29.28 D1.C
N$13  (3 unrouted)
  Top 0.2: 71.18,12.19 R13.P$2
  Top 0.4: J2.SHIELD0 71.18,12.19 | C21.P$1 R13.P$2 71.12,13.71 70.41,14.42 D3.1
N$15
  Top 0.2: J2.B5 73.84,18.26 73,19.1 73,22.1 73.76,22.86 R11.P$2
N$16  (via drill 0.3 pad 0.6)
  Top 0.2: J2.A5 74.14,15.26 v74,15.4 | v74.2,10.2 74.24,10.16 R12.P$2
  Bottom 0.2: v74,15.4 76.98,15.4 78,14.38 78,11.1 77.1,10.2 v74.2,10.2
N$42
  Top 0.5: R8.P$2 18.23,5.79 D2.C
PA02  (via drill 0.3 pad 0.6)
  Top 0.2: U1.3 39.58,33.02 38.6,34 38.6,40.64 v39.6,41.64 | v25.5,40.7 24.5,39.7 21.2,39.7 9.2,51.7 9.2,56.4 v8.6,57
  Bottom 0.2: v39.6,41.64 38.98,41.02 38.46,41.02 37.92,41.56 26.36,41.56 v25.5,40.7 | v8.6,57 8.6,59.98 J3.1
PA03  (via drill 0.3 pad 0.6)
  Top 0.2: U1.4 39.08,32.82 38.23,33.67 38.23,41.13 v38.7,41.6 | v25.5,41.6 24,40.1 21.3,40.1 9.6,51.8 9.6,56.9 3,63.5 J3.2
  Bottom 0.2: v38.7,41.6 38.6,41.6 38.31,41.89 25.79,41.89 v25.5,41.6
PA04
  Top 0.2: U1.13 34.56,28.6 34.56,29 30.83,32.73 27.64,32.73 8.8,51.56 8.8,54.7 J3.3
PA05
  Top 0.2: U1.14 34.08,28.98 30.66,32.4 27.4,32.4 8.4,51.4 8.4,52.56 J3.4
PA06
  Top 0.2: U1.15 33.58,29.02 30.57,32.03 27.27,32.03 3.42,55.88 J3.5
PA07
  Top 0.2: U1.16 33.08,28.92 30.3,31.7 27,31.7 8.06,50.64 5.24,50.64 J3.6
PA14  (via drill 0.3 pad 0.6)
  Top 0.2: U1.31 31.58,20.88 v30.7,20
  Bottom 0.2: v30.7,20 28.1,17.4 18.66,17.4 16.33,19.73 16.33,39.97 20.23,43.87 20.23,47.07 J4.7
PA15  (via drill 0.3 pad 0.6)
  Top 0.2: U1.32 31.98,20.38 v30.7,19.1
  Bottom 0.2: v30.7,19.1 28.6,17 18.6,17 16,19.6 16,40.1 19.9,44 19.9,44.87 J4.8
PA16  (via drill 0.3 pad 0.6)
  Top 0.2: U1.35 34.08,20.12 v33.4,20.8 | v27.1,40.5 27.1,62.66 J5.1
  Bottom 0.2: v33.4,20.8 31.7,22.5 31.7,33.05 27.1,37.65 v27.1,40.5
PA17  (via drill 0.3 pad 0.6)
  Top 0.2: U1.36 34.58,20.45 v34.23,20.8 | v27.93,40.5 27.93,40.97 27.5,41.4 27.5,60.52 J5.2
  Bottom 0.2: v34.23,20.8 33.62,21.41 33.31,21.41 32.05,22.67 32.05,33.32 27.93,37.44 v27.93,40.5
PA18  (via drill 0.3 pad 0.6)
  Top 0.2: U1.37 35.08,20.77 v35.05,20.8 | v28.75,40.5 28.25,41 28.25,41.11 27.83,41.53 27.83,58.31 J5.3
  Bottom 0.2: v35.05,20.8 34.05,21.81 33.41,21.81 32.4,22.82 32.4,33.6 28.75,37.24 v28.75,40.5
PA19  (via drill 0.3 pad 0.6)
  Top 0.2: U1.38 35.58,20.5 v35.88,20.8 | v29.6,40.5 28.2,41.9 28.15,41.9 28.15,56.09 J5.4
  Bottom 0.2: v35.88,20.8 34.46,22.22 33.57,22.22 32.77,23.02 32.77,33.85 29.6,37.02 v29.6,40.5
PA20  (via drill 0.3 pad 0.6)
  Top 0.2: U1.41 37.08,18.38 36.56,17.86 35.56,17.86 35,17.3 v34.97,17.3 | v34.51,38.99 34.21,39.29 31.62,39.29 29.84,41.08 29.52,41.08 28.48,42.12 28.48,53.88 J5.5
  Bottom 0.2: v34.97,17.3 34.97,18.07 36.8,19.9 37.08,19.9 37.71,20.53 37.71,21.17 35.47,23.41 34.22,23.41 33.85,23.79 33.85,38.33 v34.51,38.99
PA21  (via drill 0.3 pad 0.6)
  Top 0.2: U1.42 37.58,18.28 36.58,17.28 v35.8,17.28 | v35.31,39.39 35.01,39.69 31.69,39.69 28.81,42.57 28.81,51.67 J5.6
  Bottom 0.2: v35.8,17.28 35.8,18.1 38.14,20.44 38.14,21.31 35.66,23.79 34.47,23.79 34.22,24.04 34.22,37.89 35.31,38.98 v35.31,39.39
PB00
  Top 0.2: U1.61 41.3,26.4 42.3,26.4 42.5,26.6 43.7,26.6 51.2,34.1 51.2,59.29 J7.1
PB01
  Top 0.2: U1.62 42.18,26.88 42.3,27 43.5,27 50.8,34.3 50.8,57.15 J7.2
PB02
  Top 0.2: U1.63 43.38,27.38 50.4,34.4 50.4,55.01 J7.3
PB03
  Top 0.2: U1.64 43.28,27.88 50,34.6 50,52.87 J7.4
PB04
  Top 0.2: U1.5 38.58,32.72 37.9,33.4 37.9,49.33 J7.5
PB05  (via drill 0.3 pad 0.6)
  Top 0.2: U1.6 38.08,32.62 37.57,33.13 37.57,50.47 v41.9,54.8
  Bottom 0.2: v41.9,54.8 42.99,54.8 J7.6
PB06  (via drill 0.3 pad 0.6)
  Top 0.2: U1.9 36.58,29.98 v36.8,30.2 | v43.53,39.53 43.53,40.13 43.97,40.57 43.97,46.53 43.23,47.27 43.23,49.58 J7.7
  Bottom 0.2: v36.8,30.2 36.8,31.48 35.82,32.46 35.82,37.29 37.26,38.73 40.51,38.73 41.62,39.85 43.21,39.85 v43.53,39.53
PB07  (via drill 0.3 pad 0.6)
  Top 0.2: U1.10 36.08,31.22 v35.6,31.7 | v44.3,39.92 44.3,48.11 J7.8
  Bottom 0.2: v35.6,31.7 35.6,31.76 35.42,31.94 35.42,37.42 37.06,39.06 40.37,39.06 41.48,40.17 44.05,40.17 v44.3,39.92
PB08  (via drill 0.3 pad 0.6)
  Top 0.2: U1.11 35.58,30.54 v35.23,30.89 | v52.73,40.66 51.93,41.46 51.93,55.23 56.1,59.4 v56.1,59.5
  Bottom 0.2: v35.23,30.89 35.22,30.89 35,31.11 35,37.52 36.87,39.39 40.24,39.39 41.35,40.5 51.24,40.5 51.66,40.08 52.15,40.08 v52.73,40.66 | v56.1,59.5 56.1,63.72 J8.1
PB09  (via drill 0.3 pad 0.6)
  Top 0.2: U1.12 35.08,29.73 v34.81,30 | v51.9,40.66 51.6,40.96 51.6,56.68 J8.2
  Bottom 0.2: v34.81,30 34.6,30.21 34.6,37.69 36.63,39.72 40.1,39.72 41.24,40.86 51.7,40.86 v51.9,40.66
PB12  (via drill 0.3 pad 0.6)
  Top 0.2: U1.25 29.18,23.88 v28.9,23.6
  Bottom 0.2: v28.9,23.6 24.71,19.41 19.55,19.41 18.33,20.64 18.33,39.14 21.73,42.55 57.97,42.55 61.55,46.13 61.55,52.75 J8.5
PB13  (via drill 0.3 pad 0.6)
  Top 0.2: U1.26 29.58,23.38 v28.9,22.7
  Bottom 0.2: v28.9,22.7 25.28,19.08 19.42,19.08 18,20.5 18,39.27 21.6,42.87 57.73,42.87 61.13,46.27 61.13,50.63 J8.6
PB14  (via drill 0.3 pad 0.6)
  Top 0.2: U1.27 29.98,22.88 v28.9,21.8
  Bottom 0.2: v28.9,21.8 25.85,18.75 19.25,18.75 17.64,20.36 17.64,39.37 21.46,43.2 57.5,43.2 60.7,46.4 60.7,49.5 59.4,50.8 J8.7
PB15  (via drill 0.3 pad 0.6)
  Top 0.2: U1.28 30.38,22.38 v28.9,20.9
  Bottom 0.2: v28.9,20.9 26.43,18.43 19.04,18.43 17.31,20.15 17.31,39.51 21.4,43.6 57.36,43.6 59.42,45.66 59.42,47.26 J8.8
PB16  (via drill 0.3 pad 0.6)
  Top 0.2: U1.39 36.08,20.17 v36.71,20.8
  Bottom 0.2: v36.71,20.8 34.9,22.61 33.8,22.61 33.12,23.29 33.12,39 34.5,40.37 39.83,40.37 41.03,41.56 58.48,41.56 62.63,45.72 62.63,56.25 72.39,66 J9.1
PB17  (via drill 0.3 pad 0.6)
  Top 0.2: U1.40 36.58,18.58 36.3,18.3 35.41,18.3 35.01,17.9 34.31,17.9 v34.21,17.8
  Bottom 0.2: v34.21,17.8 36.63,20.22 36.95,20.22 37.28,20.56 37.28,21.04 35.3,23.03 33.99,23.03 33.49,23.53 33.49,38.79 34.74,40.04 39.97,40.04 41.16,41.24 58.61,41.24 62.96,45.59 62.96,54 72.39,63.43 J9.2
PB22  (via drill 0.3 pad 0.6)
  Top 0.152: U1.49 41.92,20.38 v42.4,19.9
  Bottom 0.2: v42.4,19.9 41.8,20.5 41.8,21.28 42.78,22.26 44.21,22.26 49.7,27.75 49.7,31.8 63.4,45.5 63.4,51.97 J9.3
PB23  (via drill 0.3 pad 0.6)
  Top 0.152: U1.50 42.32,20.88 v42.4,20.8
  Bottom 0.2: v42.4,20.8 42.4,21.32 42.97,21.88 44.38,21.88 50.1,27.6 50.1,31.6 63.8,45.3 63.8,49.83 J9.4
PB31
  Top 0.2: U1.60 42.48,25.88 42.8,26.2 43.9,26.2 51.6,33.9 51.6,35.6 71.88,55.88 J9.5
QSPI_CS  (via drill 0.3 pad 0.6)
  Top 0.2: v21.59,26.67 20.95,26.04 U2.1 20.95,21.78 R4.P$1 | v29.7,24.5 29.83,24.37 U1.24
  Bottom 0.2: v29.7,24.5 29.33,24.87 26.45,24.87 25.18,26.14 22.14,26.14 21.61,26.67 v21.59,26.67 20.89,26.67 18.7,28.86 18.7,39.05 21.87,42.22 58.21,42.22 61.98,45.99 61.98,54.86 J8.4
QSPI_IO0  (via drill 0.3 pad 0.6)
  Top 0.2: U1.17 30.54,27.88 29.51,28.91 v25.7,28.91 24.77,29.84 U2.5 | v24.6,41.6 23.9,42.3 21.5,42.3 21,42.8 21,61.55 J4.1
  Bottom 0.2: v25.7,28.91 v25.7,28.9 25.39,28.59 21.41,28.59 20.05,29.95 20.05,38.55 21.67,40.17 23.09,40.17 24.52,41.6 v24.6,41.6
QSPI_IO1  (via drill 0.3 pad 0.6)
  Top 0.2: U1.18 29.96,27.38 v29.78,27.2 | v22.86,26.67 22.23,26.04 U2.2 | v22.04,41.6 21.52,41.6 20.61,42.52 20.61,59.4 J4.2
  Bottom 0.2: v29.78,27.2 23.91,27.2 23.39,26.67 v22.86,26.67 22.3,27.23 20.89,27.23 19.03,29.09 19.03,38.91 21.71,41.6 v22.04,41.6
QSPI_IO2  (via drill 0.3 pad 0.6)
  Top 0.2: U2.3 23.5,26.04 v24.13,26.67 23.2,27.6 v22.9,27.6 | v30.32,26.67 30.52,26.88 U1.19 | v22.86,41.6 22.86,41.48 22.27,40.89 21.59,40.89 20.2,42.28 20.2,57.3 16.54,60.96 J4.3
  Bottom 0.2: v24.13,26.67 v30.32,26.67 | v22.9,27.6 22.8,27.7 21,27.7 19.35,29.35 19.35,38.78 21.57,40.99 22.35,40.99 22.86,41.5 v22.86,41.6
QSPI_IO3  (via drill 0.3 pad 0.6)
  Top 0.2: U2.7 22.23,29.84 v24.13,27.94 | U1.20 31.28,26.38 v31.1,26.2 | v23.7,41.6 23.68,41.6 22.54,40.46 21.46,40.46 19.8,42.12 19.8,55.1 16.51,58.39 J4.4
  Bottom 0.2: v31.1,26.2 v31.09,26.21 31.09,26.8 29.95,27.94 v24.13,27.94 24.13,27.99 23.94,28.18 21.18,28.18 19.72,29.64 19.72,38.68 21.54,40.5 22.6,40.5 v23.7,41.6
QSPI_SCK  (via drill 0.3 pad 0.6)
  Top 0.2: v30.3,25 30.42,24.88 U1.23 | v26.67,25.4 25.43,26.64 25.43,27.63 v23.5,29.56 U2.6
  Bottom 0.2: v26.67,25.4 29.9,25.4 v30.3,25 | v23.5,29.56 23.04,29.1 21.51,29.1 20.37,30.23 20.37,38.37 21.85,39.85 25.46,39.85 26.85,41.24 37.78,41.24 38.33,40.7 39.7,40.7 40.89,41.89 58.34,41.89 62.31,45.86 62.31,54.99 62.3,55 62.3,57.2 58.54,60.96 J8.3
SCL  (via drill 0.3 pad 0.6)
  Top 0.2: U1.30 31.18,21.38 v30.7,20.9 | R6.P$1 16.32,53.53 J4.6
  Bottom 0.2: v30.7,20.9 27.53,17.73 18.8,17.73 16.65,19.87 16.65,39.83 20.6,43.77 20.6,49.25 J4.6
SDA  (via drill 0.3 pad 0.6)
  Top 0.2: v30.7,21.8 30.78,21.88 U1.29 | R5.P$1 16.32,55.69 J4.5
  Bottom 0.2: v30.7,21.8 27,18.1 18.9,18.1 16.98,20.02 16.98,39.68 20.93,43.63 20.93,51.44 16.51,55.86 J4.5
SWCLK  (via drill 0.3 pad 0.6)
  Top 0.2: U1.57 43.16,24.38 v43.29,24.51 | v15.3,14.8 R3.P$1 11.92,16.84 7.59,16.84 6.65,17.78 TC1.4
  Bottom 0.2: v15.3,14.8 23.69,14.8 24.75,15.87 36.66,15.87 37.39,16.6 37.39,18.14 43.27,24.02 43.27,24.49 v43.29,24.51
SWDIO  (via drill 0.3 pad 0.6)
  Top 0.2: U1.58 42.76,24.88 42.97,25.08 v43.89,25.08
  Bottom 0.2: TC1.2 6.55,15.44 15.68,15.44 15.99,15.13 23.55,15.13 24.67,16.24 36.4,16.24 36.92,16.76 36.92,18.18 42.66,23.92 42.66,24.72 42.97,25.03 43.02,25.08 v43.89,25.08
  other vias: 6.35,15.24
SWO  (via drill 0.3 pad 0.6)
  Top 0.2: U1.59 41.3,25.4 42.7,25.4 42.98,25.69 v44.47,25.69
  Bottom 0.2: TC1.6 5.08,18.22 7.53,15.77 15.81,15.77 16.12,15.45 23.42,15.45 24.59,16.63 36.05,16.63 36.45,17.03 36.45,18.26 42.23,24.04 42.23,24.84 43.08,25.69 v44.47,25.69
  other vias: 5.08,19.05
USB_DM  (via drill 0.3 pad 0.6)
  Top 0.2: U1.45 39.08,19.1 39.24,18.95 39.24,18.55 39.41,18.38 39.41,17.97 38.32,16.89 v38.32,16.06 | v73.94,16.78 73.95,16.76 J2.A7 76.11,16.75 76.35,16.51 76.35,16.01 76.1,15.77 J2.B7 | v69.2,17.4 70.19,17.4 D3.4 70.21,28.3 J6.1
  Bottom 0.2: v73.94,16.78 70.11,16.78 69.49,17.4 v69.2,17.4 69.2,17.72 68.82,18.1 47.32,18.1 46.38,17.17 40.26,17.17 39.19,16.09 38.35,16.09 v38.32,16.06
USB_DP  (via drill 0.3 pad 0.6)
  Top 0.2: U1.46 39.58,18.72 39.75,18.55 39.75,17.49 v38.98,16.71 | 75.25,17.31 J2.B6 74.4,17.26 74.31,17.35 72.18,17.35 | 75.28,16.24 J2.A6 74.4,16.26 74.34,16.2 73.33,16.2 72.18,17.35 | 72.18,17.35 D3.3 71.21,17.42 v71.2,17.43 71.2,18.03 70.6,18.63 70.6,26.15 J6.2
  Bottom 0.2: v38.98,16.71 v38.99,16.71 39.84,17.57 46.32,17.57 47.21,18.46 69.08,18.46 70.1,17.43 v71.2,17.43
VCC  (via drill 0.3 pad 0.6)
  Top 0.35: U4.3 63.83,39.05 v63.5,39.37 C22.P$1
  Top 0.6: J1.1 74.6,40.97 74.6,34.31 73.39,33.1 70.3,33.1 59.46,22.26 SW2.2
  Bottom 0.5: v63.5,39.37 68.58,39.37 J1.1
VDD  (via drill 0.3 pad 0.6)
  Top 0.25: 40.7,9.7 40.64,9.64 | 40.64,9.64 U3.4 | U3.3 40.14,9.14 40.64,9.64
  Top 0.6: F1.1 46.77,9.53 46.33,9.97 C17.P$1 v43.1,9.97 C18.P$1 40.97,9.97 40.7,9.7 | v28.7,14.7 25.3,18.1 19.2,18.1 4.28,33.02 J10.5 J10.4
  Bottom 0.6: v43.1,9.97 33.43,9.97 v28.7,14.7
VDDANA
  Top 0.305: U1.8 37.08,29.08 37.58,29.58 37.58,30.81 C10.P$1
  Top 0.5: C10.P$1 35.56,32.83 35.56,35.11 C4.P$1 33.84,36.83 L2.1
VIN  (via drill 0.3 pad 0.6)
  Top 0.5: 50.52,9.5 F1.2
  Top 0.6: SW2.3 62.46,7.84 v60.8,9.5 | v52,9.5 50.52,9.5
  Bottom 0.6: v60.8,9.5 v52,9.5
VSUP
  Top 0.2: 72.3,5.17 J11.1
  Top 0.6: SW2.4 72.3,5.17
VUSB  (via drill 0.3 pad 0.6)
  Top 0.2: v74,14.1 74.93,14.1 J2.A4/B9 | 72.1,15.24 D3.2 | 75.28,18.92 J2.B4/A9
  Top 0.4: J2.B4/A9 75.99,18.91 76.22,18.68 76.53,18.68 76.91,18.29 76.91,14.66 76.6,14.35 76.22,14.35 75.98,14.1 74.93,14.1
  Top 0.5: J2.A4/B9 | v74,14.1 72.7,14.1 72.1,14.7 72.1,15.24
  Top 0.6: J2.A4/B9 v74,14.1 | v58.42,13.97 57.96,13.51 SW2.1
  Bottom 0.6: v74,14.1 73.87,13.97 v58.42,13.97
XIN32
  Top 0.2: U1.1 40.58,31.33 44.53,35.28 X1.1 45.87,35.56 C11.P$1
XOUT32
  Top 0.2: U1.2 40.08,31.46 41.83,33.21 X1.2 40.49,35.56 C12.P$1

### Text on the board
tPlace: * | PA02 | PA08 | PA16 | PB00 | PB08 | PB16 | PA03 | PA09 | * | PA17 | PB01 | PB09 | PB17 | * | * | PA04 | PA10 | PA18 | PB02 | PB10 | PB22 | * | * | PA05 | PA11 | PA19 | PB03 | PB11 | PB23 | * | PA06 | PA12 | PA20 | PB04 | PB12 | PB31 | * | PA07 | PA13 | PA21 | PB05 | PB13 | * | * = special funcion | PA14 | PA22 | PB06 | PB14 | * | PA15 | PA23 | PB07 | PB15 | 5V5 Max | 3V3 | VCC | CC | 3V3 | CANH | Designed in Portugal | 3V3 | CANL | VDD | GND | VDD | * | GND | ATSAME51 | PA24 | * | GND | PA25 | LED | * | GND | PA26 | PWR-SEL | SWD | github/gimbas | USB | CAN | VSUP | 15V Max | VSUP | RST | PWR | GND
bPlace: IO0 | IO1 | QSPI | IO2 | Q SCK | IO3 | Q CS | SDA | SCL | TX | CAN | RX | CC | DM | USB | DP | LED | github/gimbas | SAME51-DevBoard / V1.0 / #5019